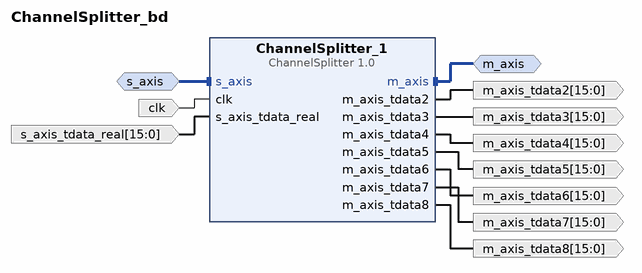
[diagram p0: block diagram of the top level]
# Vivado block design ChannelSplitter_bd, xczu28dr-ffvg1517-2-e, Vivado 2024.1
create_bd_design ChannelSplitter_bd

create_bd_intf_port -mode Master -vlnv xilinx.com:interface:axis_rtl:1.0 m_axis
create_bd_intf_port -mode Slave -vlnv xilinx.com:interface:axis_rtl:1.0 s_axis
set_property -dict [list \
  CONFIG.HAS_TKEEP 0 \
  CONFIG.HAS_TLAST 1 \
  CONFIG.HAS_TREADY 1 \
  CONFIG.HAS_TSTRB 0 \
  CONFIG.LAYERED_METADATA {['xilinx.com:interface:datatypes:1.0 {', 'TDATA {datatype {name {attribs {resolve_type immediate dependency {} format string minimum {} maximum {}} value {}} bitwidth {attribs {resolve_type immediate dependency {} format long minimum {}', 'maximum {}} value 16} bitoffset {attribs {resolve_type immediate dependency {} format long minimum {} maximum {}} value 0} real {fixed {fractwidth {attribs {resolve_type immediate dependency {} format', 'long minimum {} maximum {}} value 0} signed {attribs {resolve_type immediate dependency {} format bool minimum {} maximum {}} value false}}}}}', '}']} \
  CONFIG.TDATA_NUM_BYTES 2 \
  CONFIG.TDEST_WIDTH 0 \
  CONFIG.TID_WIDTH 0 \
  CONFIG.TUSER_WIDTH 0 \
] [get_bd_intf_ports s_axis]
create_bd_port -dir I -type clk clk
create_bd_port -dir O -from 15 -to 0 -type data m_axis_tdata2
create_bd_port -dir O -from 15 -to 0 -type data m_axis_tdata3
create_bd_port -dir O -from 15 -to 0 -type data m_axis_tdata4
create_bd_port -dir O -from 15 -to 0 -type data m_axis_tdata5
create_bd_port -dir O -from 15 -to 0 -type data m_axis_tdata6
create_bd_port -dir O -from 15 -to 0 -type data m_axis_tdata7
create_bd_port -dir O -from 15 -to 0 -type data m_axis_tdata8
create_bd_port -dir I -from 15 -to 0 -type data s_axis_tdata_real

create_bd_cell -type ip -vlnv User_Company:VMC:ChannelSplitter:1.0 ChannelSplitter_1

# ---- connections ----

connect_bd_intf_net [get_bd_intf_pins ChannelSplitter_1/m_axis] [get_bd_intf_ports m_axis]
connect_bd_intf_net [get_bd_intf_pins ChannelSplitter_1/s_axis] [get_bd_intf_ports s_axis]
connect_bd_net [get_bd_pins ChannelSplitter_1/m_axis_tdata2] [get_bd_ports m_axis_tdata2]
connect_bd_net [get_bd_pins ChannelSplitter_1/m_axis_tdata3] [get_bd_ports m_axis_tdata3]
connect_bd_net [get_bd_pins ChannelSplitter_1/m_axis_tdata4] [get_bd_ports m_axis_tdata4]
connect_bd_net [get_bd_pins ChannelSplitter_1/m_axis_tdata5] [get_bd_ports m_axis_tdata5]
connect_bd_net [get_bd_pins ChannelSplitter_1/m_axis_tdata6] [get_bd_ports m_axis_tdata6]
connect_bd_net [get_bd_pins ChannelSplitter_1/m_axis_tdata7] [get_bd_ports m_axis_tdata7]
connect_bd_net [get_bd_pins ChannelSplitter_1/m_axis_tdata8] [get_bd_ports m_axis_tdata8]
connect_bd_net [get_bd_ports clk] [get_bd_pins ChannelSplitter_1/clk]
connect_bd_net [get_bd_ports s_axis_tdata_real] [get_bd_pins ChannelSplitter_1/s_axis_tdata_real]

validate_bd_design
save_bd_design
